# EAGLE design MSP430_BNC_breakout_v2 (EAGLE 9.6.2)
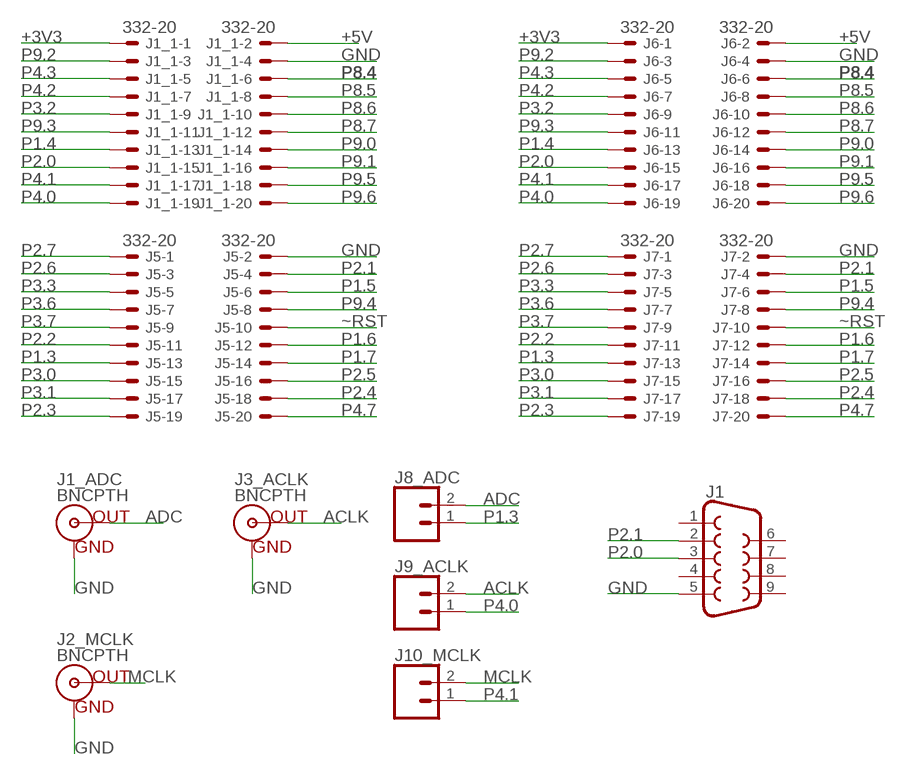
[diagram p0: schematic, sheet 1]

## Parts
J1  DB9FEMALE  [DB9]
J1_1  332-20  [332-20]
J1_ADC  BNCPTH  [BNC]
J2_MCLK  BNCPTH  [BNC]
J3_ACLK  BNCPTH  [BNC]
J5  332-20  [332-20]
J6  332-20  [332-20]
J7  332-20  [332-20]
J8_ADC  CONN_02  [1X02]
J9_ACLK  CONN_02  [1X02]
J10_MCLK  CONN_02  [1X02]

## Nets
+3V3: J1_1.1 J6.1
+5V: J1_1.2 J6.2
ACLK: J3_ACLK.S(OUT) J9_ACLK.2
ADC: J1_ADC.S(OUT) J8_ADC.2
GND: J1.5 J1_1.4 J1_ADC.GND J2_MCLK.GND J3_ACLK.GND J5.2 J6.4 J7.2
MCLK: J2_MCLK.S(OUT) J10_MCLK.2
P1.3: J5.13 J7.13 J8_ADC.1
P1.4: J1_1.13 J6.13
P1.5: J5.6 J7.6
P1.6: J5.12 J7.12
P1.7: J5.14 J7.14
P2.0: J1.3 J1_1.15 J6.15
P2.1: J1.2 J5.4 J7.4
P2.2: J5.11 J7.11
P2.3: J5.19 J7.19
P2.4: J5.18 J7.18
P2.5: J5.16 J7.16
P2.6: J5.3 J7.3
P2.7: J5.1 J7.1
P3.0: J5.15 J7.15
P3.1: J5.17 J7.17
P3.2: J1_1.9 J6.9
P3.3: J5.5 J7.5
P3.6: J5.7 J7.7
P3.7: J5.9 J7.9
P4.0: J1_1.19 J6.19 J9_ACLK.1
P4.1: J1_1.17 J6.17 J10_MCLK.1
P4.2: J1_1.7 J6.7
P4.3: J1_1.5 J6.5
P4.7: J5.20 J7.20
P8.4: J1_1.6 J6.6
P8.5: J1_1.8 J6.8
P8.6: J1_1.10 J6.10
P8.7: J1_1.12 J6.12
P9.0: J1_1.14 J6.14
P9.1: J1_1.16 J6.16
P9.2: J1_1.3 J6.3
P9.3: J1_1.11 J6.11
P9.4: J5.8 J7.8
P9.5: J1_1.18 J6.18
P9.6: J1_1.20 J6.20
~RST: J5.10 J7.10
Unconnected: J1.1 J1.4 J1.6 J1.7 J1.8 J1.9

## Library data of the parts
J1 = SparkFun-Connectors:DB9: DB9 Connector Standard DB9 (D-Sub 9) serial connector. Can be used for CAN bus as well as RS485 and RS232. Footprint production proven. Here is the female version connector we sell at SparkFun: 9 Pin Female Serial Connector - PCB Mount <https://www.sparkfun.com/products/429> (PRT-00429) This connector has been used on the following SparkFun products: SparkFun RS232 Shifter - SMD <https://www.sparkfun.com/products/449> (PRT-00449) SparkFun RS232 Shifter SMD (No DB9) <https://www.sparkfun.com/products/8780> (PRT-08780); PROD_ID: CONN-08194
J1_1 J5-J7 = con-garry:332-20: 20 Pin - 2mm Dual Row Source: www.mpe-connector.de / garry_shortform_2012.pdf
J1_ADC J2_MCLK J3_ACLK = SparkFun-Connectors:BNC: BNC Right Angle Connector Mouser Part# 5227161 SparkFun Products: BNC Connector - Right Angle <https://www.sparkfun.com/products/10550>; PROD_ID: LPA-12729; SF_ID: PRT-10550
J8_ADC J9_ACLK J10_MCLK = SparkFun-Connectors:CONN_02: Multi connection point. Often used as Generic Header-pin footprint for 0.1 inch spaced/style header connections On any of the 0.1 inch spaced packages, you can populate with these: Break Away Headers - Straight <https://www.sparkfun.com/products/116> (PRT-00116) Break Away Male Headers - Right Angle <https://www.sparkfun.com/products/553> (PRT-00553) Female Headers <https://www.sparkfun.com/products/115> (PRT-00115) Break Away Headers - Machine Pin <https://www.sparkfun.com/products/117> (PRT-00117) Break Away Female Headers - Swiss Machine Pin <https://www.sparkfun.com/products/743> (PRT-00743) For SCREWTERMINALS and SPRING TERMINALS visit here: Screw Terimnals on SparkFun.com <https://www.sparkfun.com/search/results?term=Screw+Terminals> (5mm/3.5mm/2.54mm spacing) This device is also useful as a general connection point to wire up your design to another part of your project. Our various solder wires solder well into these plated through hole pads. Hook-Up Wire - Assortment (Stranded, 22 AWG) <https://www.sparkfun.com/products/11375> (PRT-11375) Hook-Up Wire - Assortment (Solid Core, 22 AWG) <https://www.sparkfun.com/products/11367> (PRT-11367) View the entire wire category on our website here <https://www.sparkfun.com/categories/141> Special notes: Molex polarized connector foot print use with: PRT-08233 with associated crimp pins and housings. 2.54_SCREWTERM for use with PRT-10571. 3.5mm Screw Terminal footprints for PRT-08084 5mm Screw Terminal footprints for use with PRT-08432

## Net classes
0 default: width 0.254 mm, drill 0.9 mm, clearance 0.254 mm
1 power: width 0.381 mm, drill 0.9 mm, clearance 0.254 mm
2 gnd: width 0.254 mm, drill 0.9 mm, clearance 0.254 mm
3 usbvcc: width 0.381 mm, drill 0.9 mm, clearance 0.254 mm
4 aref: width 0.254 mm, drill 0.9 mm, clearance 0.254 mm

## Board
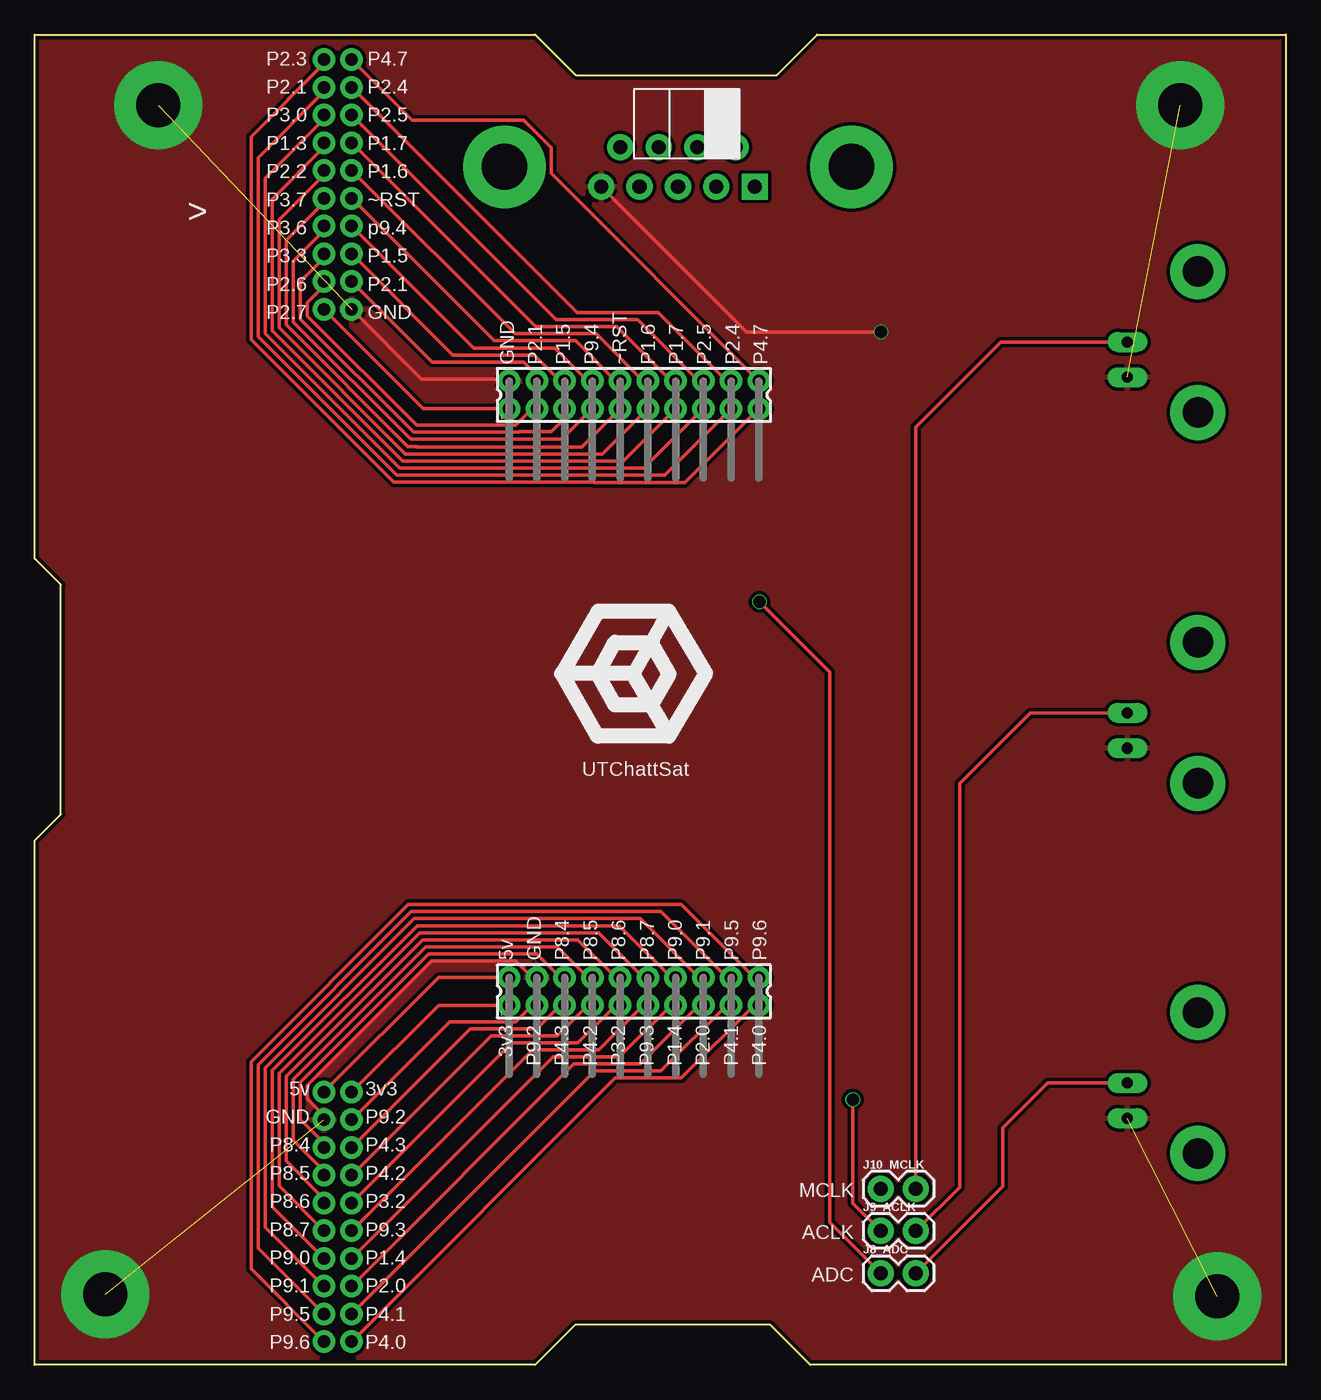
[diagram p1: board, top side]
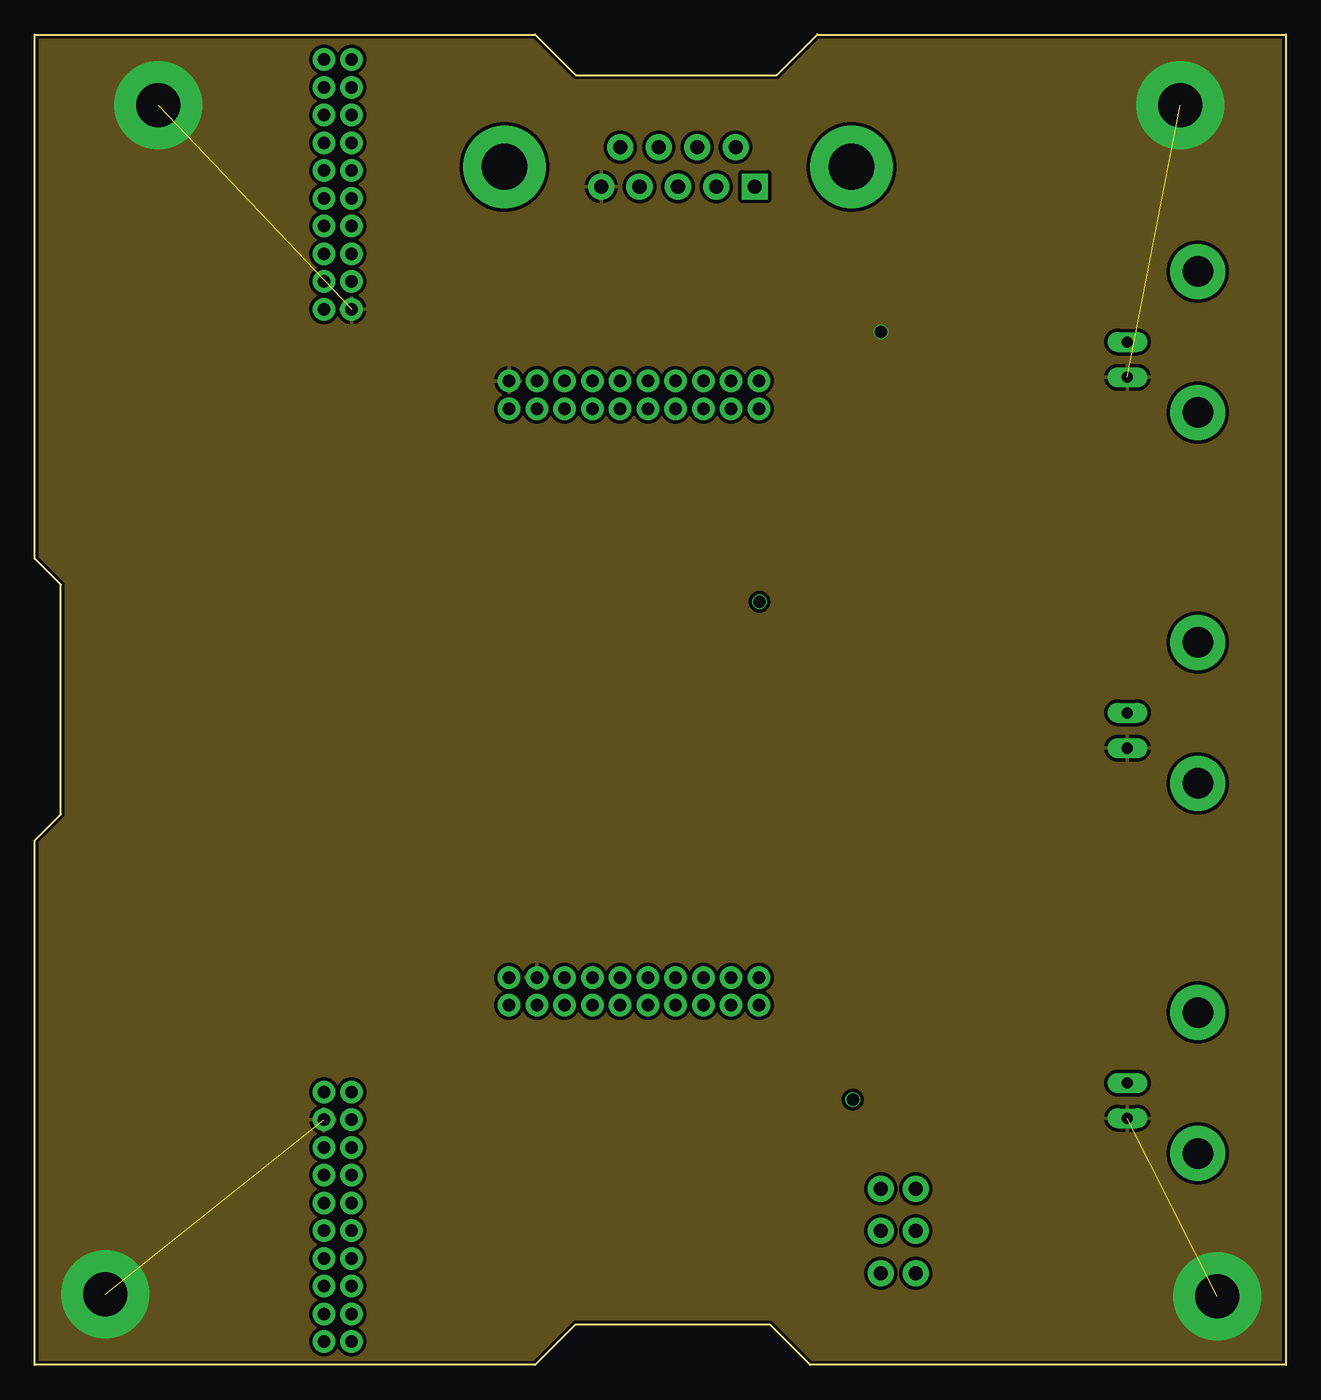
[diagram p2: board, inner layer DO_NOT_USE]
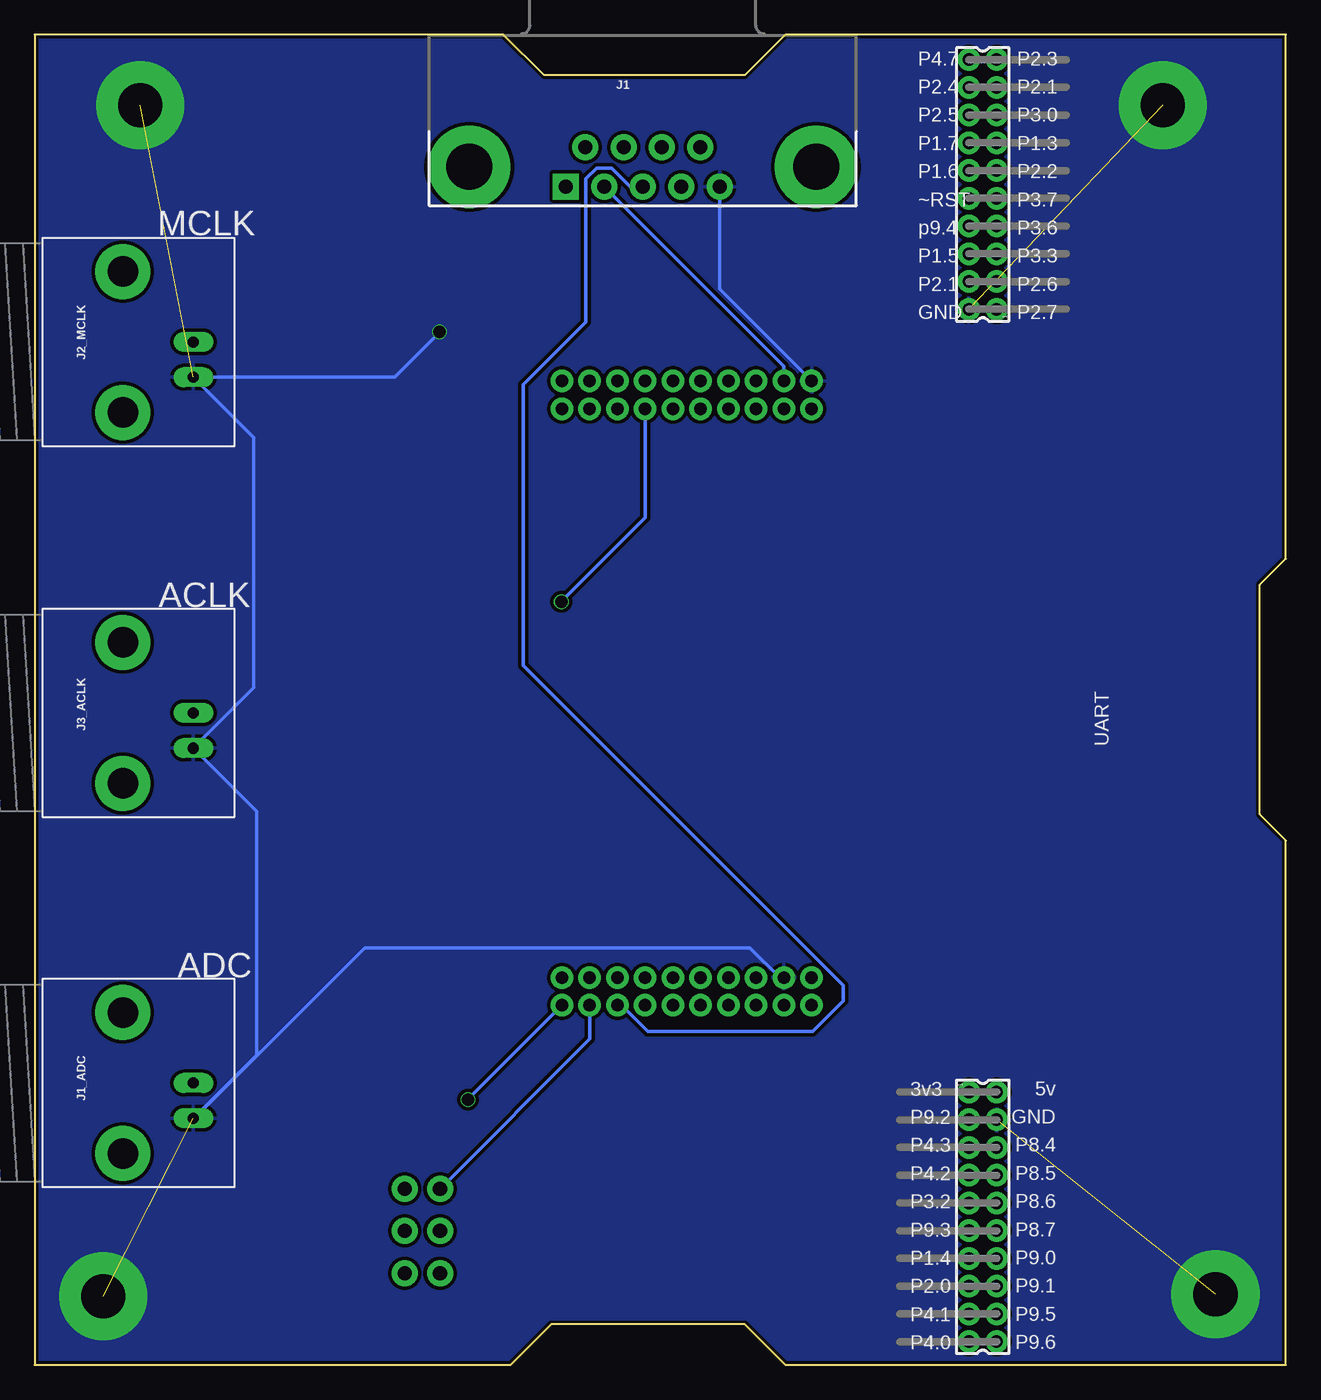
[diagram p3: board, bottom side, seen from below]

Size 90.17 x 95.89 mm. Coordinates in mm from the lower left corner, seen from the top.
Outline: 0,0 0,37.8 1.88,39.67 1.88,56.24 0,58.12 0,95.89 36.07,95.89 38.99,92.96 53.47,92.96 56.39,95.89 90.17,95.89 90.17,0 55.88,0 52.96,2.92 38.99,2.92 36.07,0 0,0
Copper layers (1*16): Top 0.035mm / dielectric 1.6mm / Bottom 0.035mm
Design rules "jlcpcb-2layers *": minimum track width 5mil, minimum drill 0.3mm, track to track 5mil, track to pad 5mil, pad to pad 5mil, via to via 5mil, smd to smd 5mil, copper to edge 0.2mm, drill to drill 6mil, minimum pad ring 10mil, minimum via ring 3mil, stop-mask expansion 4mil, vias tented up to drill 0mil, thermal gap 10mil

### Footprints (pad centres in the part's own frame; a part is rotated, then mirrored left to right if it is on the bottom)
DB9 = drill 1.016 pad 1.88 square: 1 -5.54,-1.42 | drill 1.016 pad 1.88: 2 -2.77,-1.42; 3 0,-1.42; 4 2.77,-1.42; 5 5.54,-1.42; 6 -4.15,1.42; 7 -1.38,1.42; 8 1.38,1.42; 9 4.15,1.42 | drill 3.302 pad 5.08: G1 -12.5,0; G2 12.5,0
332-20 = drill 0.9 pad 1.27: 1 -9,-1; 2 -9,1; 3 -7,-1; 4 -7,1; 5 -5,-1; 6 -5,1; 7 -3,-1; 8 -3,1; 9 -1,-1; 10 -1,1; 11 1,-1; 12 1,1; 13 3,-1; 14 3,1; 15 5,-1; 16 5,1; 17 7,-1; 18 7,1; 19 9,-1; 20 9,1
BNC = drill 2.2: 3 -5.08,5.08; 4 5.08,5.08 | drill 0.8 long: GND -2.54,0; S 0,0
1X02 = drill 1.016 pad 1.88: 1 0,0; 2 2.54,0

### Placement (x,y rotation side)
J1  46.35,86.36 0 bottom
J1_1  43.18,26.92 0 top
J1_ADC  78.74,20.32 90 bottom
J2_MCLK  78.74,73.74 90 bottom
J3_ACLK  78.74,46.99 90 bottom
J5  43.18,69.92 0 top
J6  21.84,10.67 270 bottom
J7  21.84,85.09 90 bottom
J8_ADC  60.96,6.6 0 top
J9_ACLK  60.96,9.65 0 top
J10_MCLK  60.96,12.7 0 top

### Tracks (layer width: path | path; a pad name or v marks a point on that pad's centre or on a via)
+3V3
  Top 0.254: J6.1 29.1,25.92 J1_1.1
+5V
  Top 0.254: J6.2 29.1,27.92 J1_1.2
ACLK
  Top 0.254: J9_ACLK.2 66.65,12.8 66.65,41.91 71.73,46.99 J3_ACLK.S
ADC
  Top 0.254: J8_ADC.2 69.77,12.88 69.77,17.09 73,20.32 J1_ADC.S
GND  (via drill 0.9, 3.17 pad 6.35)  (4 unrouted)
  Top 0.254: J1_1.4 35.86,27.92 34.67,29.11 28.61,29.11 19.65,20.16 19.65,19.18 20.84,17.98 J6.4 | J7.2 27.86,71.07 34.03,71.07 J5.2 | J1.5 51.31,74.45 v60.98,74.45
  Bottom 0.254: J1_1.4 36.5,27.92 38.63,30.05 66.39,30.05 78.74,17.7 J1_ADC.GND 74.17,22.35 74.17,39.88 J3_ACLK.GND 74.37,48.82 74.37,66.83 J2_MCLK.GND 64.24,71.2 v60.98,74.45 | J1.5 40.81,77.56 J5.2
  other vias: 5.08,5.08 8.89,90.81 82.55,90.81 85.22,4.95
  pour Top (isolate 0.254): 0,0 0,37.8 1.88,39.67 1.88,56.24 0,58.12 0,95.89 36.07,95.89 38.99,92.96 53.47,92.96 56.39,95.89 90.17,95.89 90.17,0 55.88,0 52.96,2.92 38.99,2.92 36.07,0
  pour DO_NOT_USE: 0,96.01 0,58.17 2.03,56.13 2.03,39.88 0,37.85 0,0 36.07,0 38.86,2.79 53.09,2.79 55.88,0 56.13,0 90.17,0 90.17,95.76 56.13,95.76 53.34,92.96 38.86,92.96 36.07,95.76 1.52,95.76
  pour Bottom: 0,96.52 90.17,96.52 90.17,0 0,0
MCLK
  Top 0.254: J10_MCLK.2 63.5,67.61 69.62,73.74 J2_MCLK.S
P1.3  (via drill 0.9)
  Top 0.254: J7.13 20.84,87.77 17.11,84.04 17.11,74.55 26.51,65.15 42.41,65.15 J5.13 | J8_ADC.1 57.3,10.26 57.3,49.94 v52.22,55.02
  Bottom 0.254: v52.22,55.02 46.18,61.06 J5.13
P1.4
  Top 0.254: J6.13 37.37,22.19 42.13,22.19 45.86,25.92 J1_1.13
P1.5
  Top 0.254: J7.6 30.14,72.8 35.99,72.8 37.86,70.92 J5.6
P1.6
  Top 0.254: J7.12 34.61,74.32 40.47,74.32 43.86,70.92 J5.12
P1.7
  Top 0.254: J7.14 36.11,74.83 41.96,74.83 45.86,70.92 J5.14
P2.0
  Top 0.254: J6.15 38.86,21.68 43.62,21.68 47.86,25.92 J1_1.15
  Bottom 0.254: J1.3 47.26,84.94 48.58,86.26 49.67,86.26 50.45,85.49 50.45,75.18 54.97,70.66 54.97,50.4 31.92,27.35 31.92,26.24 34.12,24.05 45.99,24.05 47.86,25.92 J1_1.15
P2.1
  Top 0.254: J7.4 28.65,72.29 35.23,72.29 36.18,71.34 J5.4
  Bottom 0.254: J1.2 36.18,72 J5.4
P2.2
  Top 0.254: J7.11 20.84,85.77 17.62,82.55 17.62,74.75 26.72,65.66 40.91,65.66 J5.11
P2.3
  Top 0.254: J7.19 20.84,93.77 15.59,88.52 15.59,73.91 25.88,63.63 40.31,63.63 40.34,63.6 46.86,63.6 J5.19
P2.4
  Top 0.254: J7.18 39.09,75.84 44.94,75.84 49.86,70.92 J5.18
P2.5
  Top 0.254: J7.16 37.6,75.34 43.45,75.34 47.86,70.92 J5.16
P2.6
  Top 0.254: J5.3 35.86,68.92 34.67,67.73 27.52,67.73 19.65,75.6 19.65,75.62 19.65,76.58 20.84,77.77 J7.3
P2.7
  Top 0.254: J7.1 28.01,68.92 J5.1
P3.0
  Top 0.254: J7.15 20.84,89.77 16.61,85.53 16.61,74.33 26.3,64.64 43.9,64.64 J5.15
P3.1
  Top 0.254: J7.17 20.84,91.77 16.1,87.03 16.1,74.12 26.09,64.14 45.39,64.14 J5.17
P3.2
  Top 0.254: J6.9 34.38,23.21 39.15,23.21 41.86,25.92 J1_1.9
P3.3
  Top 0.254: J7.5 20.84,79.77 19.14,78.08 19.14,75.39 27.31,67.22 34.88,67.22 34.92,67.26 37.24,67.26 38.18,68.2 J5.5
P3.6
  Top 0.254: J7.7 20.84,81.77 18.64,79.57 18.64,75.18 27.1,66.72 37.97,66.72 J5.7
P3.7
  Top 0.254: J7.9 20.84,83.77 18.13,81.06 18.13,74.97 26.89,66.21 27.52,66.21 27.56,66.17 39.42,66.17 J5.9
P4.0  (via drill 0.9)
  Top 0.254: J6.19 41.84,20.67 46.61,20.67 51.86,25.92 J1_1.19 | J9_ACLK.1 58.95,11.66 v58.95,19.13
  Bottom 0.254: v58.95,19.13 52.18,25.9 J1_1.19
P4.1
  Top 0.254: J6.17 40.35,21.18 45.12,21.18 49.86,25.92 J1_1.17
  Bottom 0.254: J10_MCLK.1 50.18,23.48 J1_1.17
P4.2
  Top 0.254: J6.7 32.89,23.72 37.66,23.72 39.86,25.92 J1_1.7
P4.3
  Top 0.254: J6.5 31.4,24.23 36.16,24.23 37.86,25.92 J1_1.5
P4.7
  Top 0.254: J7.20 27.22,89.71 35.24,89.71 37.21,87.75 37.21,85.9 J5.20
P8.4
  Top 0.254: J1_1.6 37.86,27.92 36.16,29.62 28.4,29.62 19.14,20.37 19.14,17.68 20.84,15.98 J6.6
P8.5
  Top 0.254: J1_1.8 39.86,27.92 37.66,30.13 28.19,30.13 18.64,20.58 18.64,16.19 20.84,13.98 J6.8
P8.6
  Top 0.254: J1_1.10 41.86,27.92 39.15,30.64 27.98,30.64 18.13,20.79 18.13,14.7 20.84,11.98 J6.10
P8.7
  Top 0.254: J1_1.12 43.86,27.92 40.64,31.15 27.77,31.15 17.62,21 17.62,12.89 J6.12
P9.0
  Top 0.254: J1_1.14 45.86,27.92 42.13,31.66 27.55,31.66 17.11,21.21 17.11,11.4 J6.14
P9.1
  Top 0.254: J1_1.16 47.86,27.92 43.62,32.16 27.34,32.16 16.61,21.42 16.61,9.91 J6.16
P9.2
  Top 0.254: J1_1.3 35.86,25.92 34.67,24.73 29.91,24.73 J6.3
P9.3
  Top 0.254: J6.11 35.88,22.7 40.64,22.7 43.86,25.92 J1_1.11
P9.4
  Top 0.254: J7.8 31.63,73.3 37.48,73.3 39.86,70.92 J5.8
P9.5
  Top 0.254: J1_1.18 49.86,27.92 45.12,32.67 27.13,32.67 16.1,21.63 16.1,8.41 J6.18
P9.6
  Top 0.254: J1_1.20 51.86,27.92 46.61,33.18 26.92,33.18 15.59,21.84 15.59,6.92 J6.20
~RST
  Top 0.254: J7.10 33.12,73.81 38.98,73.81 41.86,70.92 J5.10

### Text on the board
tPlace: > | P2.3 / P2.1 / P3.0 / P1.3 / P2.2 / P3.7 / P3.6 / P3.3 / P2.6 / P2.7 | P4.7 / P2.4 / P2.5 / P1.7 / P1.6 / ~RST / p9.4 / P1.5 / P2.1 / GND | GND / P2.1 / P1.5 / P9.4 / ~RST / P1.6 / P1.7 / P2.5 / P2.4 / P4.7 | UTChattSat | 5v / GND / P8.4 / P8.5 / P8.6 / P8.7 / P9.0 / P9.1 / P9.5 / P9.6 | 3v3 / P9.2 / P4.3 / P4.2 / P3.2 / P9.3 / P1.4 / P2.0 / P4.1 / P4.0 | 5v / GND / P8.4 / P8.5 / P8.6 / P8.7 / P9.0 / P9.1 / P9.5 / P9.6 | 3v3 / P9.2 / P4.3 / P4.2 / P3.2 / P9.3 / P1.4 / P2.0 / P4.1 / P4.0 | MCLK / ACLK / ADC
bPlace: MCLK | P2.3 / P2.1 / P3.0 / P1.3 / P2.2 / P3.7 / P3.6 / P3.3 / P2.6 / P2.7 | P4.7 / P2.4 / P2.5 / P1.7 / P1.6 / ~RST / p9.4 / P1.5 / P2.1 / GND | ACLK | UART | ADC | 5v / GND / P8.4 / P8.5 / P8.6 / P8.7 / P9.0 / P9.1 / P9.5 / P9.6 | 3v3 / P9.2 / P4.3 / P4.2 / P3.2 / P9.3 / P1.4 / P2.0 / P4.1 / P4.0